# Altium schematic sheet Sheet1.SchDoc: panel
size A3; DrawnBy: wjk
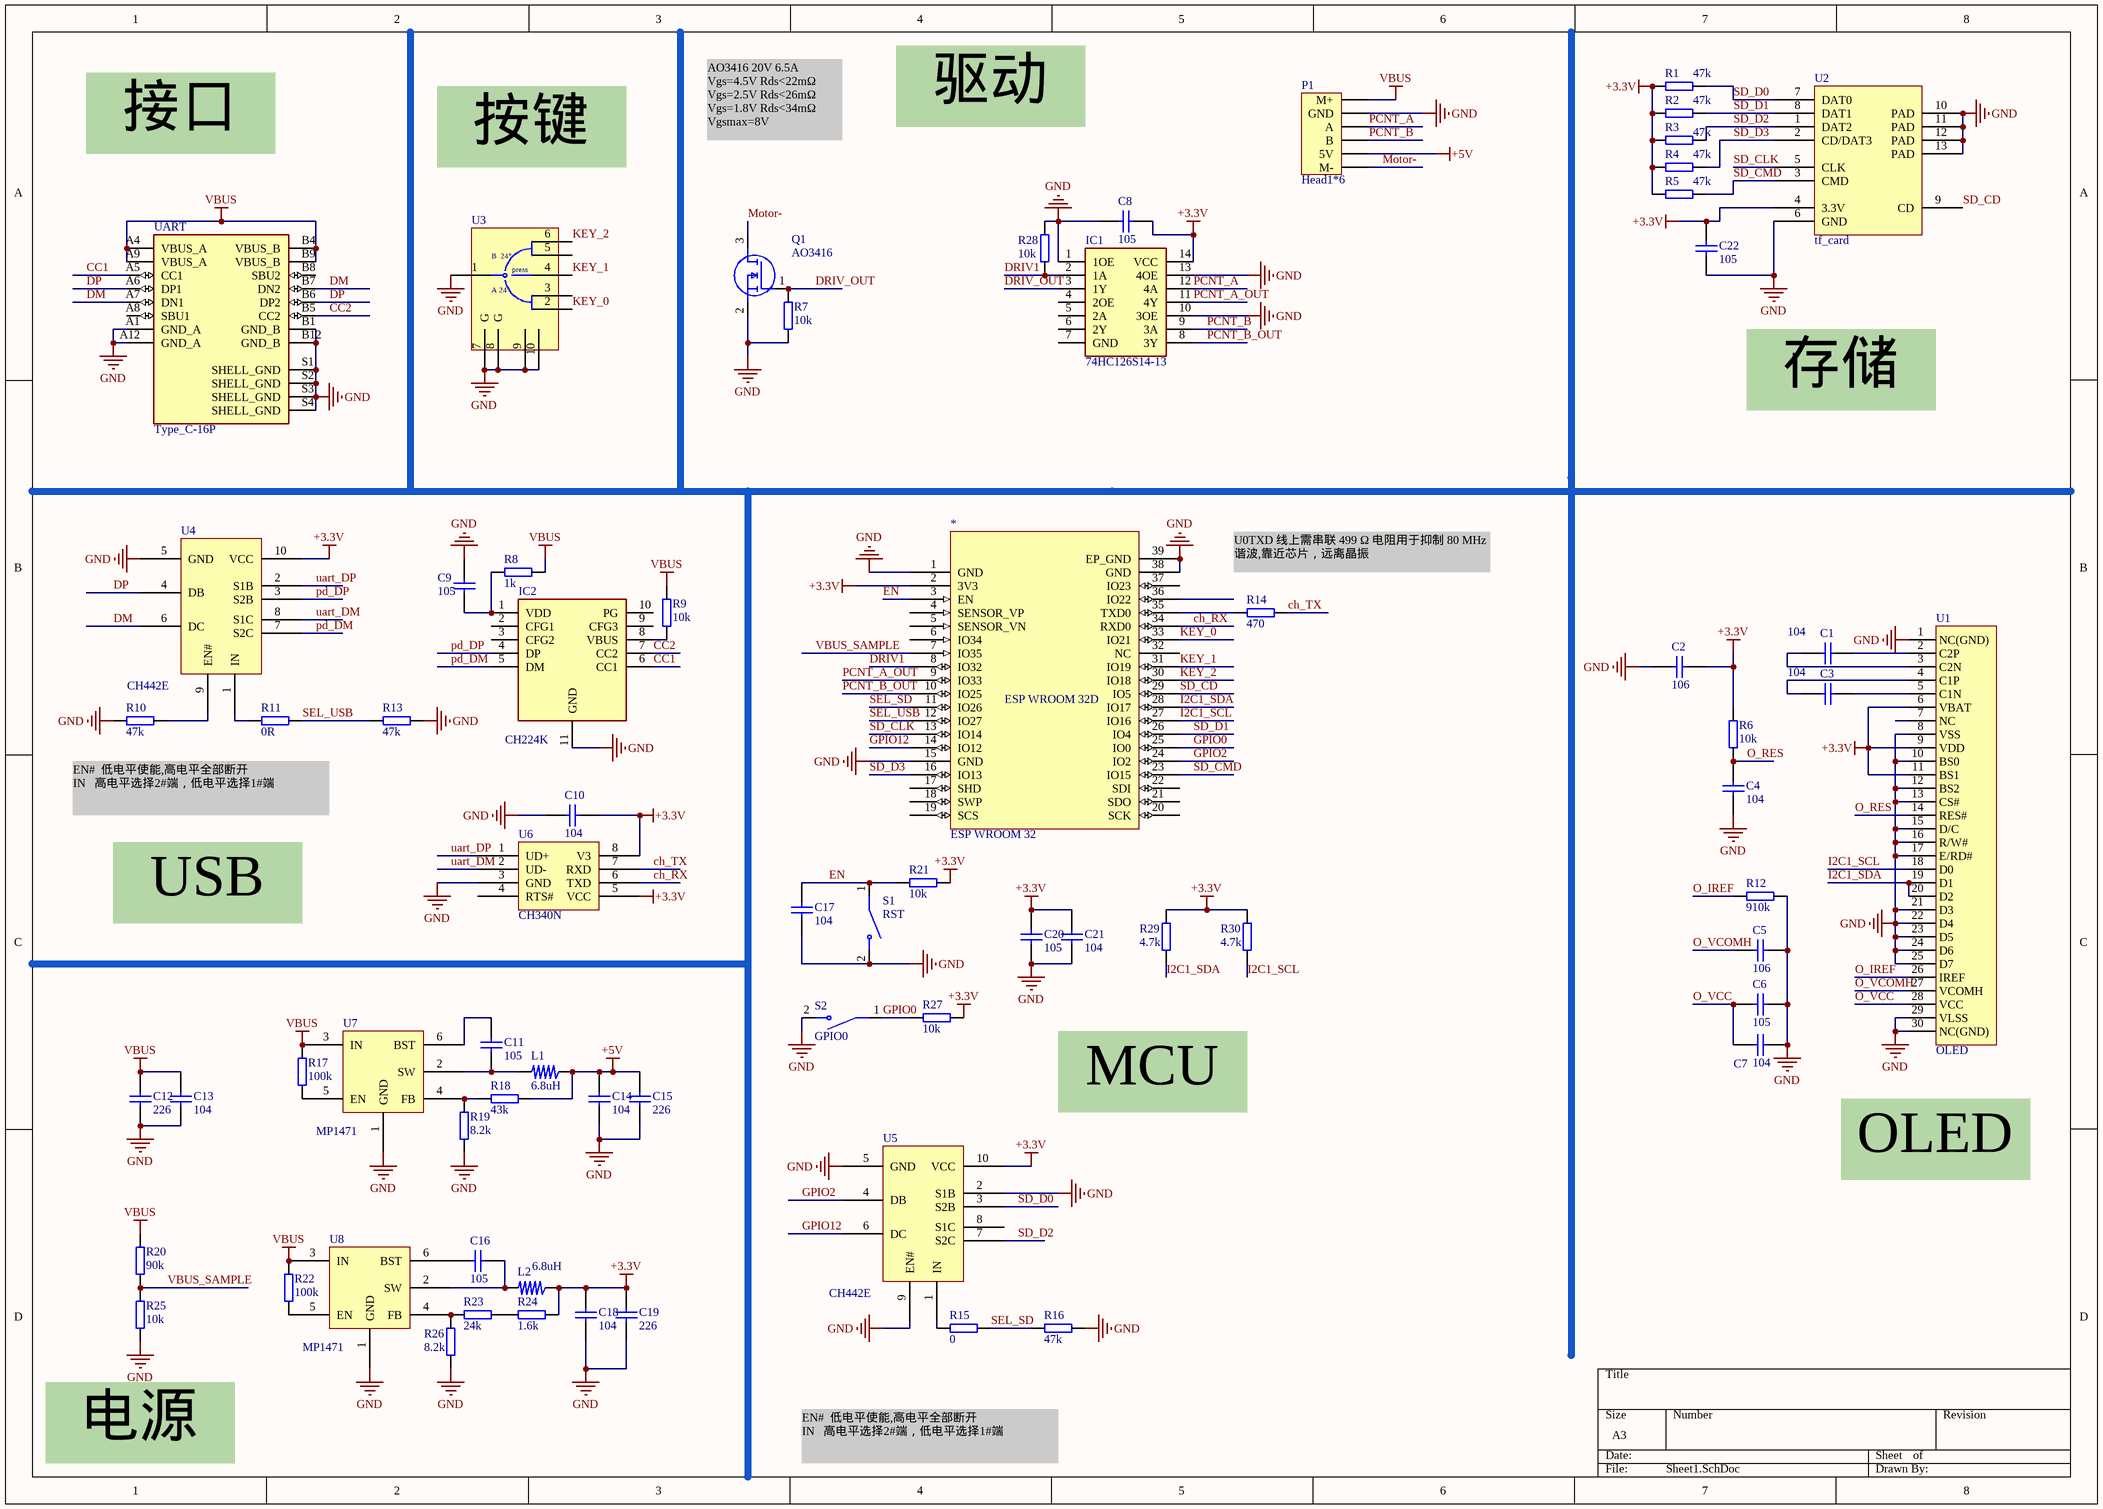
[diagram p0: Sheet1.SchDoc]

## Parts
*  ESP WROOM 32  [ESP32-WROOM-32D]
C1  104  [CAPC1608[0603]]
C2  106  [CAPC1608[0603]]
C3  104  [CAPC1608[0603]]
C4  104  [CAPC1608[0603]]
C5  106  [CAPC1608[0603]]
C6  105  [CAPC1608[0603]]
C7  104  [CAPC1608[0603]]
C8  105  [CAPC1608[0603]]
C9  105  [CAPC1608[0603]]
C10  104  [CAPC1608[0603]]
C11  105  [CAPC1608[0603]]
C12  226  [CAPC1608[0603]]
C13  104  [CAPC1608[0603]]
C14  104  [CAPC1608[0603]]
C15  226  [CAPC1608[0603]]
C16  105  [CAPC1608[0603]]
C17  104  [CAPC1608[0603]]
C18  104  [CAPC1608[0603]]
C19  226  [CAPC1608[0603]]
C20  105  [CAPC1608[0603]]
C21  104  [CAPC1608[0603]]
C22  105  [CAPC1608[0603]]
IC1  74HC126S14-13  [SOIC127P600X173-14N]
IC2  CH224K  [SOP100P600X180-11N]
L1  6.8uH  [WHC0420]
L2  6.8uH  [WHC0420]
P1  Head1*6  [Header1*6]
Q1  AO3416  [SOT95P237X112-3N]
R1  47k  [RESC1608[0603]]
R2  47k  [RESC1608[0603]]
R3  47k  [RESC1608[0603]]
R4  47k  [RESC1608[0603]]
R5  47k  [RESC1608[0603]]
R6  10k  [RESC1608[0603]]
R7  10k  [RESC1608[0603]]
R8  1k  [RESC1608[0603]]
R9  10k  [RESC1608[0603]]
R10  47k  [RESC1608[0603]]
R11  0R  [RESC1608[0603]]
R12  910k  [RESC1608[0603]]
R13  47k  [RESC1608[0603]]
R14  470  [RESC1608[0603]]
R15  0  [RESC1608[0603]]
R16  47k  [RESC1608[0603]]
R17  100k  [RESC1608[0603]]
R18  43k  [RESC1608[0603]]
R19  8.2k  [RESC1608[0603]]
R20  90k  [RESC1608[0603]]
R21  10k  [RESC1608[0603]]
R22  100k  [RESC1608[0603]]
R23  24k  [RESC1608[0603]]
R24  1.6k  [RESC1608[0603]]
R25  10k  [RESC1608[0603]]
R26  8.2k  [RESC1608[0603]]
R27  10k  [RESC1608[0603]]
R28  10k  [RESC1608[0603]]
R29  4.7k  [RESC1608[0603]]
R30  4.7k  [RESC1608[0603]]
S1  RST  [SW_B3U-1000P]
S2  GPIO0  [SW_B3U-1000P]
U1  OLED  [OLED-panel]
U2  tf_card  [TF-1]
U3  拨码开关  [FS-1501S-02]  (value not drawn)
U4  CH442E  [MSOP-10]
U5  CH442E  [MSOP-10]
U6  CH340N  [SOP8]
U7  MP1471  [TSOT23-6]
U8  MP1471  [TSOT23-6]
UART  Type_C-16P  [VALCON_CSP-USC16-TR]

## Nets
+3.3V: *.2(3V3) C2.1 C8.2 C10.1 C18.1 C19.1 C20.1 C21.1 C22.2 IC1.14(VCC) L2.1 R1.2 R2.2 R3.2 R4.2 R5.2 R6.1 R21.1 R24.2 R27.1 R29.1 R30.1 U1.6(VBAT) U1.9(VDD) U1.11(BS1) U2.4(3.3V) U4.10(VCC) U5.10(VCC) U6.5(VCC) U6.8(V3)
+5V: C14.1 C15.1 L1.1 P1.5(5V) R18.2
GND: *.1(GND) *.15(GND) *.38(GND) *.39(EP_GND) C2.2 C4.2 C5.2 C6.1 C7.2 C8.1 C9.1 C10.2 C12.2 C13.2 C14.2 C15.2 C17.2 C18.2 C19.2 C20.2 C21.2 C22.1 IC1.1(1OE) IC1.10(3OE) IC1.13(4OE) IC2.11(GND) P1.2(GND) Q1.2(S) R7.1 R10.2 R12.2 R13.1 R16.1 R19.2 R25.2 R26.2 R28.1 S1.2 S2.2 U1.1(NC(GND)) U1.8(VSS) U1.10(BS0) U1.12(BS2) U1.13(CS#) U1.15(D/C) U1.16(R/W#) U1.17(E/RD#) U1.21(D3) U1.22(D4) U1.23(D5) U1.24(D6) U1.25(D7) U1.29(VLSS) U1.30(NC(GND)) U2.6(GND) U2.10(PAD) U2.11(PAD) U2.12(PAD) U2.13(PAD) U3.1 U3.7(G) U3.8(G) U3.9 U3.10 U4.5(GND) U5.2(S1B) U5.5(GND) U5.9(EN#) U6.3(GND) U7.1(GND) U8.1(GND) UART.A1(GND_A) UART.A12(GND_A) UART.B1(GND_B) UART.B12(GND_B) UART.S1(SHELL_GND) UART.S2(SHELL_GND) UART.S3(SHELL_GND) UART.S4(SHELL_GND)
VBUS: C12.1 C13.1 P1.1(M+) R8.2 R9.2 R17.1 R20.1 R22.1 U7.3(IN) U8.3(IN) UART.A4(VBUS_A) UART.A9(VBUS_A) UART.B4(VBUS_B) UART.B9(VBUS_B)
CC1: IC2.6(CC1) UART.A5(CC1)
CC2: IC2.7(CC2) UART.B5(CC2)
ch_RX: *.34(RXD0) U6.6(TXD)
ch_TX: R14.1 U6.7(RXD)
DM: U4.6(DC) UART.A7(DN1) UART.B7(DN2)
DP: U4.4(DB) UART.A6(DP1) UART.B6(DP2)
DRIV1: *.8(IO32) IC1.2(1A) R28.2
DRIV_OUT: IC1.3(1Y) Q1.1(G) R7.2
EN: *.3(EN) C17.1 R21.2 S1.1
GPIO0: *.25(IO0) R27.2 S2.1
GPIO2: *.24(IO2) U5.4(DB)
GPIO12: *.14(IO12) U5.6(DC)
I2C1_SCL: *.27(IO16) R30.2 U1.18(D0)
I2C1_SDA: *.28(IO17) R29.2 U1.19(D1) U1.20(D2)
KEY_0: *.33(IO21) U3.2
KEY_1: *.31(IO19) U3.4
KEY_2: *.30(IO18) U3.6
Motor-: P1.6(M-) Q1.3(D)
O_IREF: R12.1 U1.26(IREF)
O_RES: C4.1 R6.2 U1.14(RES#)
O_VCC: C6.2 C7.1 U1.28(VCC)
O_VCOMH: C5.1 U1.27(VCOMH)
PCNT_A: IC1.12(4A) P1.3(A)
PCNT_A_OUT: *.9(IO33) IC1.11(4Y)
PCNT_B: IC1.9(3A) P1.4(B)
PCNT_B_OUT: *.10(IO25) IC1.8(3Y)
pd_DM: IC2.5(DM) U4.7(S2C)
pd_DP: IC2.4(DP) U4.3(S2B)
SD_CD: *.29(IO5) U2.9(CD)
SD_CLK: *.13(IO14) U2.5(CLK)
SD_CMD: *.23(IO15) R5.1 U2.3(CMD)
SD_D0: R1.1 U2.7(DAT0) U5.3(S2B)
SD_D1: *.26(IO4) R2.1 U2.8(DAT1)
SD_D2: R3.1 U2.1(DAT2) U5.7(S2C)
SD_D3: *.16(IO13) R4.1 U2.2(CD/DAT3)
SEL_SD: *.11(IO26) R15.1 R16.2
SEL_USB: *.12(IO27) R11.1 R13.2
uart_DM: U4.8(S1C) U6.2(UD-)
uart_DP: U4.2(S1B) U6.1(UD+)
VBUS_SAMPLE: *.7(IO35) R20.2 R25.1
Net*_35: *.35(TXD0) R14.2
NetC1_1: C1.1 U1.3(C2N)
NetC1_2: C1.2 U1.2(C2P)
NetC3_1: C3.1 U1.4(C1P)
NetC3_2: C3.2 U1.5(C1N)
NetC9_2: C9.2 IC2.1(VDD) R8.1
NetC11_1: C11.1 U7.6(BST)
NetC11_2: C11.2 L1.2 U7.2(SW)
NetC16_1: C16.1 U8.6(BST)
NetC16_2: C16.2 L2.2 U8.2(SW)
NetIC2_8: IC2.8(VBUS) R9.1
NetR10_1: R10.1 U4.9(EN#)
NetR11_2: R11.2 U4.1(IN)
NetR15_2: R15.2 U5.1(IN)
NetR17_2: R17.2 U7.5(EN)
NetR18_1: R18.1 R19.1 U7.4(FB)
NetR22_2: R22.2 U8.5(EN)
NetR23_1: R23.1 R26.1 U8.4(FB)
NetR23_2: R23.2 R24.1

Not connected (* = marked no-connect by the designer): * 4(SENSOR_VP) 5(SENSOR_VN) 6(IO34) 17(SHD) 18(SWP) 19(SCS) 20(SCK) 21(SDO) 22(SDI) 32(NC) 36(IO22) 37(IO23); IC1 4(2OE) 5(2A) 6(2Y) 7(GND); IC2 2(CFG1) 3(CFG2) 9(CFG3) 10(PG); U1 7(NC); U3 3 5; U5 8(S1C); U6 4(RTS#); UART A8(SBU1) B8(SBU2)

## Notes on the sheet
- 接口
- 按键
- AO3416 20V 6.5A
  Vgs=4.5V Rds<22mΩ
  Vgs=2.5V Rds<26mΩ
  Vgs=1.8V Rds<34mΩ
  Vgsmax=8V
- 驱动
- 存储
- (near R14) U0TXD 线上需串联 499 Ω 电阻用于抑制 80 MHz 谐波,靠近芯片，远离晶振
- EN#  低电平使能,高电平全部断开
  IN   高电平选择2#端，低电平选择1#端
- USB
- MCU
- OLED
- 电源
- (in symbol ESP WROOM 32) ESP WROOM 32D
- (in symbol thumb key) B  24°; press; A 24°

## Library data of the parts
C1-C22 = Cap Chip 1: Chip Capacitor, PSpice Model; Tolerance: Y5V; Voltage: 3V; Published: 8-Jun-2000; Revision: July-2002: Re-released for DXP Platform.; Publisher: Altium Limited; Price(RMB): 0.000
  C1 C3 C4 C7 C10 C13 C14 C17 C18 C21: Value: 104
  C2 C5: Value: 106
  C6 C8 C9 C11 C16 C20 C22: Value: 105
  C12 C15 C19: Value: 226
IC1 = 74HC126S14-13: Integrated Circuit; Manufacturer_Name: Diodes Inc.; Datasheet Link: https://www.mouser.com/datasheet/2/115/74HC126-247323.pdf; Height: 1.73mm; Manufacturer_Part_Number: 74HC126S14-13; Mouser Part Number: 621-74HC126S14-13; Mouser Price/Stock: https://www.mouser.co.uk/ProductDetail/Diodes-Incorporated/74HC126S14-13?qs=pYVYkI7xuRXC0F6VGtFBIA%3D%3D; Arrow Part Number: 74HC126S14-13; Arrow Price/Stock: https://www.arrow.com/en/products/74hc126s14-13/diodes-incorporated
IC2 = CH224K: Integrated Circuit; Manufacturer_Name: WCH; Datasheet Link: https://datasheet.lcsc.com/lcsc/2204251615_WCH-Jiangsu-Qin-Heng-CH224K_C970725.pdf; Height: 1.8mm; Manufacturer_Part_Number: CH224K
L1 L2 = L: Value: 22uH
P1 = Header1x6
Q1 = AO3416: MOSFET (N-Channel); Manufacturer_Name: Alpha & Omega Semiconductors; Datasheet Link: https://www.arrow.com/en/products/ao3416/alpha-and-omega-semiconductor; Height: 1.12mm; Manufacturer_Part_Number: AO3416; Arrow Part Number: AO3416; Arrow Price/Stock: https://www.arrow.com/en/products/ao3416/alpha-and-omega-semiconductor?region=nac
R1-R14 R16-R30 = Res Chip 2p 1: Chip Resistor, PSpice Model, IPC PCB Library Drawing; Tolerance: 5%; TC1: 0; Published: 8-Jun-2000; Revision: July-2002: Re-released for DXP Platform.; Publisher: Altium Limited; Price(RMB): 0.000; TC2: 0
  R1-R5 R10 R13 R16: Value: 47k
  R6 R7 R9 R21 R25 R27 R28: Value: 10k
  R8: Value: 1k
  R11: Value: 0R
  R12: Value: 910k
  R14: Value: 470
  R17 R22: Value: 100k
  R18: Value: 43k
  R19 R26: Value: 8.2k
  R20: Value: 90k
  R23: Value: 24k
  R24: Value: 1.6k
  R29 R30: Value: 4.7k
R15 = Res Chip 2p 1: Chip Resistor, PSpice Model, IPC PCB Library Drawing; Tolerance: 5%; Published: 8-Jun-2000; Revision: July-2002: Re-released for DXP Platform.; Publisher: Altium Limited; Price(RMB): 0.000; TC1: 0; TC2: 0; Value: 0
S1 S2 = SW2P: MP: B3U-1000P; Price: None; Availability: Unavailable; Value: *; Package: None
U1 = 0.96寸OLED
U2 = TF- SDIO
U3 = thumb key
U6 = CH340N: USB to serial chip CH340N
U7 U8 = MP1471: 4.7v-16V Input / 16V3A / 500K
UART = Type_C-16P: CSP-USC16-TR Valcon USB Type C Surface Mount PCB Socket; Package: None; Purchase-URL: https://pricing.snapeda.com/search/part/CSP-USC16-TR/?ref=eda; MP: CSP-USC16-TR; Check_prices: https://www.snapeda.com/parts/CSP-USC16-TR/Valcon/view-part/4783629/?ref=eda; MF: Valcon; Value: *; Availability: No availability data; Price: None; SnapEDA_Link: https://www.snapeda.com/parts/CSP-USC16-TR/Valcon/view-part/4783629/?ref=snap